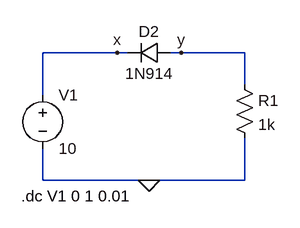
[diagram p0: schematic silicon diode reverse biased.asc]
silicon diode reverse biased.asc, the LTspice schematic file:
Version 4
SHEET 1 880 680
WIRE 224 48 112 48
WIRE 240 48 224 48
WIRE 320 48 304 48
WIRE 416 48 320 48
WIRE 416 96 416 48
WIRE 112 112 112 48
WIRE 112 240 112 192
WIRE 272 240 112 240
WIRE 416 240 416 176
WIRE 416 240 272 240
FLAG 272 240 0
FLAG 224 48 x
FLAG 320 48 y
SYMBOL voltage 112 96 R0
SYMATTR InstName V1
SYMATTR Value 10
SYMBOL diode 304 32 R90
WINDOW 0 0 32 VBottom 2
WINDOW 3 32 32 VTop 2
SYMATTR InstName D2
SYMATTR Value 1N914
SYMBOL res 400 80 R0
SYMATTR InstName R1
SYMATTR Value 1k
TEXT 80 264 Left 2 !.dc V1 0 1 0.01

The netlist it stands for:
* silicon diode reverse biased.asc
V1 x 0 10
D2 y x 1N914
R1 y 0 1k
.model D D
.lib standard.dio
.dc V1 0 1 0.01
.backanno
.end